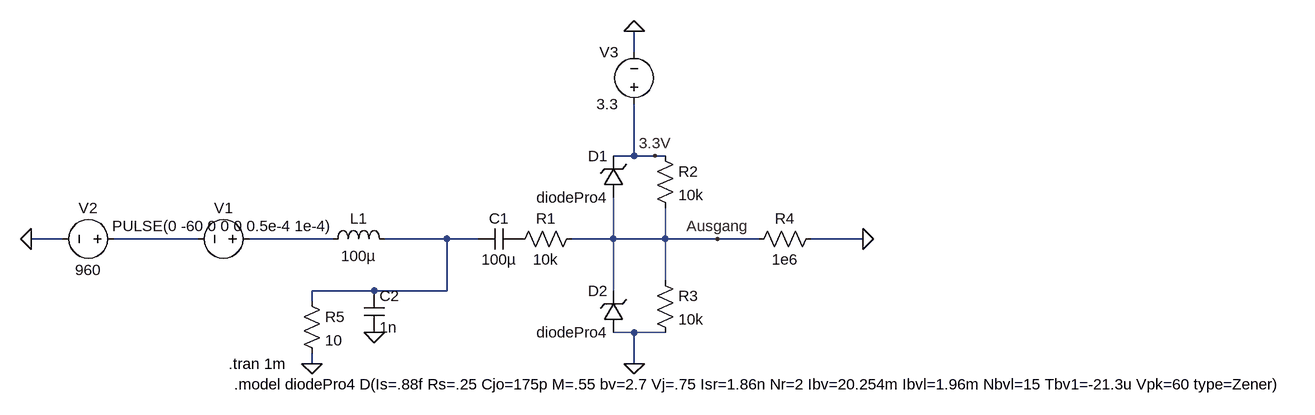
[diagram p0: schematic receiver_master.asc]
receiver_master.asc, the LTspice schematic file:
Version 4
SHEET 1 1372 680
WIRE 224 -128 224 -160
WIRE 224 32 224 -48
WIRE 224 32 192 32
WIRE 256 32 224 32
WIRE 272 32 256 32
WIRE -656 160 -704 160
WIRE -448 160 -576 160
WIRE -240 160 -368 160
WIRE -64 160 -160 160
WIRE -16 160 -64 160
WIRE 192 160 192 96
WIRE 192 160 128 160
WIRE 272 160 272 112
WIRE 272 160 192 160
WIRE 352 160 272 160
WIRE 416 160 352 160
WIRE 576 160 496 160
WIRE 272 224 272 160
WIRE -176 240 -272 240
WIRE -64 240 -64 160
WIRE -64 240 -176 240
WIRE 192 240 192 160
WIRE -272 256 -272 240
WIRE 224 304 192 304
WIRE 272 304 224 304
WIRE -272 352 -272 336
WIRE 224 352 224 304
FLAG 576 160 0
FLAG -704 160 0
FLAG 352 160 Ausgang
FLAG 224 352 0
FLAG 256 32 3.3V
FLAG 224 -160 0
FLAG -272 352 0
FLAG -176 304 0
SYMBOL cap 48 144 R90
WINDOW 0 0 32 VBottom 2
WINDOW 3 32 32 VTop 2
SYMATTR InstName C1
SYMATTR Value 100µ
SYMBOL res 144 144 R90
WINDOW 0 0 56 VBottom 2
WINDOW 3 32 56 VTop 2
SYMATTR InstName R1
SYMATTR Value 10k
SYMBOL zener 208 96 R180
WINDOW 0 24 64 Left 2
WINDOW 3 24 0 Left 2
SYMATTR InstName D1
SYMATTR Value diodePro4
SYMATTR Description Diode
SYMATTR Type diode
SYMBOL zener 208 304 R180
WINDOW 0 24 64 Left 2
WINDOW 3 24 0 Left 2
SYMATTR InstName D2
SYMATTR Value diodePro4
SYMATTR Description Diode
SYMATTR Type diode
SYMBOL res 256 16 R0
SYMATTR InstName R2
SYMATTR Value 10k
SYMBOL res 256 208 R0
SYMATTR InstName R3
SYMATTR Value 10k
SYMBOL res 512 144 R90
WINDOW 0 0 56 VBottom 2
WINDOW 3 32 56 VTop 2
SYMATTR InstName R4
SYMATTR Value 1e6
SYMBOL voltage -352 160 R90
WINDOW 0 -32 56 VBottom 2
WINDOW 3 -4 56 VBottom 2
WINDOW 123 60 56 VTop 2
WINDOW 39 0 0 Left 2
SYMATTR InstName V1
SYMATTR Value PULSE(0 -60 0 0 0 0.5e-4 1e-4)
SYMBOL voltage -560 160 R90
WINDOW 0 -32 56 VBottom 2
WINDOW 3 32 56 VTop 2
WINDOW 123 0 0 Left 2
WINDOW 39 0 0 Left 2
SYMATTR InstName V2
SYMATTR Value 960
SYMBOL voltage 224 -32 R180
WINDOW 0 24 96 Left 2
WINDOW 3 24 16 Left 2
WINDOW 123 0 0 Left 2
WINDOW 39 0 0 Left 2
SYMATTR InstName V3
SYMATTR Value 3.3
SYMBOL res -288 240 R0
SYMATTR InstName R5
SYMATTR Value 10
SYMBOL ind -256 176 R270
WINDOW 0 32 56 VTop 2
WINDOW 3 5 56 VBottom 2
SYMATTR InstName L1
SYMATTR Value 100µ
SYMBOL cap -192 240 R0
SYMATTR InstName C2
SYMATTR Value 1n
TEXT -400 352 Left 2 !.tran 1m
TEXT -392 384 Left 2 !.model diodePro4 D(Is=.88f Rs=.25 Cjo=175p M=.55 bv=2.7 Vj=.75 Isr=1.86n Nr=2 Ibv=20.254m Ibvl=1.96m Nbvl=15 Tbv1=-21.3u Vpk=60 type=Zener)

The netlist it stands for:
* receiver_master.asc
C1 P001 N003 100µ
R1 Ausgang P001 10k
D1 Ausgang 3.3V diodePro4
D2 0 Ausgang diodePro4
R2 3.3V Ausgang 10k
R3 Ausgang 0 10k
R4 0 Ausgang 1e6
V1 N002 N001 PULSE(0 -60 0 0 0 0.5e-4 1e-4)
V2 N001 0 960
V3 3.3V 0 3.3
R5 N003 0 10
L1 N002 N003 100µ
C2 N003 0 1n
.model D D
.lib standard.dio
.tran 1m
.model diodePro4 D(Is=.88f Rs=.25 Cjo=175p M=.55 bv=2.7 Vj=.75 Isr=1.86n Nr=2 Ibv=20.254m Ibvl=1.96m Nbvl=15 Tbv1=-21.3u Vpk=60 type=Zener)
.backanno
.end